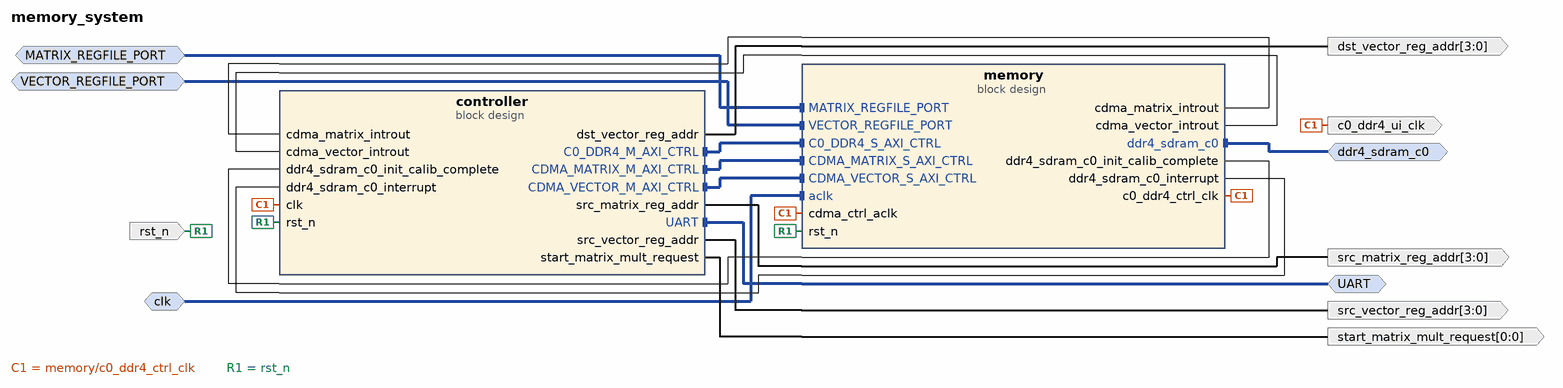
[diagram p0: block diagram of the top level]
# Vivado block design memory_system, xcu250-figd2104-2L-e, Vivado 2024.1
create_bd_design memory_system

create_bd_intf_port -mode Slave -vlnv xilinx.com:interface:diff_clock_rtl:1.0 clk
set_property -dict {CONFIG.FREQ_HZ 300000000} [get_bd_intf_ports clk]
create_bd_intf_port -mode Master -vlnv xilinx.com:interface:ddr4_rtl:1.0 ddr4_sdram_c0
create_bd_intf_port -mode Slave -vlnv xilinx.com:interface:bram_rtl:1.0 MATRIX_REGFILE_PORT
set_property -dict {CONFIG.READ_WRITE_MODE READ_WRITE} [get_bd_intf_ports MATRIX_REGFILE_PORT]
create_bd_intf_port -mode Slave -vlnv xilinx.com:interface:bram_rtl:1.0 VECTOR_REGFILE_PORT
set_property -dict {CONFIG.READ_WRITE_MODE READ_WRITE} [get_bd_intf_ports VECTOR_REGFILE_PORT]
create_bd_intf_port -mode Master -vlnv xilinx.com:interface:uart_rtl:1.0 UART
create_bd_port -dir I -type rst rst_n
set_property -dict {CONFIG.POLARITY ACTIVE_LOW} [get_bd_ports rst_n]
create_bd_port -dir O -from 0 -to 0 start_matrix_mult_request
create_bd_port -dir O -from 3 -to 0 src_matrix_reg_addr
create_bd_port -dir O -from 3 -to 0 src_vector_reg_addr
create_bd_port -dir O -from 3 -to 0 dst_vector_reg_addr
create_bd_port -dir O -type clk c0_ddr4_ui_clk

create_bd_cell -type container -reference controller controller
set_property -dict [list \
  CONFIG.ACTIVE_SIM_BD controller.bd \
  CONFIG.ACTIVE_SYNTH_BD controller.bd \
  CONFIG.ENABLE_DFX 0 \
  CONFIG.LIST_SIM_BD controller.bd \
  CONFIG.LIST_SYNTH_BD controller.bd \
  CONFIG.LOCK_PROPAGATE 0 \
] [get_bd_cells controller]
create_bd_cell -type container -reference memory memory
set_property -dict [list \
  CONFIG.ACTIVE_SIM_BD memory.bd \
  CONFIG.ACTIVE_SYNTH_BD memory.bd \
  CONFIG.ENABLE_DFX 0 \
  CONFIG.LIST_SIM_BD memory.bd \
  CONFIG.LIST_SYNTH_BD memory.bd \
  CONFIG.LOCK_PROPAGATE 0 \
] [get_bd_cells memory]

# ---- connections ----

connect_bd_intf_net -intf_net MATRIX_REGFILE_PORT_0_1 [get_bd_intf_ports MATRIX_REGFILE_PORT] [get_bd_intf_pins memory/MATRIX_REGFILE_PORT]
connect_bd_intf_net -intf_net VECTOR_REGFILE_PORT_0_1 [get_bd_intf_ports VECTOR_REGFILE_PORT] [get_bd_intf_pins memory/VECTOR_REGFILE_PORT]
connect_bd_intf_net -intf_net controller_C0_DDR4_S_AXI_CTRL [get_bd_intf_pins controller/C0_DDR4_M_AXI_CTRL] [get_bd_intf_pins memory/C0_DDR4_S_AXI_CTRL]
connect_bd_intf_net -intf_net controller_CDMA_MATRIX_S_AXI_CTRL [get_bd_intf_pins controller/CDMA_MATRIX_M_AXI_CTRL] [get_bd_intf_pins memory/CDMA_MATRIX_S_AXI_CTRL]
connect_bd_intf_net -intf_net controller_CDMA_VECTOR_S_AXI_CTRL [get_bd_intf_pins controller/CDMA_VECTOR_M_AXI_CTRL] [get_bd_intf_pins memory/CDMA_VECTOR_S_AXI_CTRL]
connect_bd_intf_net [get_bd_intf_ports UART] [get_bd_intf_pins controller/UART]
connect_bd_intf_net -intf_net default_300mhz_clk0_1 [get_bd_intf_ports clk] [get_bd_intf_pins memory/aclk]
connect_bd_intf_net -intf_net memory_0_ddr4_sdram_c0 [get_bd_intf_ports ddr4_sdram_c0] [get_bd_intf_pins memory/ddr4_sdram_c0]
connect_bd_net [get_bd_pins controller/dst_vector_reg_addr] [get_bd_ports dst_vector_reg_addr]
connect_bd_net [get_bd_pins controller/src_matrix_reg_addr] [get_bd_ports src_matrix_reg_addr]
connect_bd_net [get_bd_pins controller/src_vector_reg_addr] [get_bd_ports src_vector_reg_addr]
connect_bd_net [get_bd_pins controller/start_matrix_mult_request] [get_bd_ports start_matrix_mult_request]
connect_bd_net [get_bd_pins memory/c0_ddr4_ctrl_clk] [get_bd_ports c0_ddr4_ui_clk] [get_bd_pins controller/clk] [get_bd_pins memory/cdma_ctrl_aclk]
connect_bd_net [get_bd_pins memory/cdma_matrix_introut] [get_bd_pins controller/cdma_matrix_introut]
connect_bd_net [get_bd_pins memory/cdma_vector_introut] [get_bd_pins controller/cdma_vector_introut]
connect_bd_net [get_bd_pins memory/ddr4_sdram_c0_init_calib_complete] [get_bd_pins controller/ddr4_sdram_c0_init_calib_complete]
connect_bd_net [get_bd_pins memory/ddr4_sdram_c0_interrupt] [get_bd_pins controller/ddr4_sdram_c0_interrupt]
connect_bd_net -net resetn_1 [get_bd_ports rst_n] [get_bd_pins controller/rst_n] [get_bd_pins memory/rst_n]

# ---- address map ----
assign_bd_address -offset 0x00000000 -range 128K -target_address_space [get_bd_addr_spaces controller/microblaze_riscv/Data] [get_bd_addr_segs controller/microblaze_riscv_local_memory/dlmb_bram_if_cntlr/SLMB/Mem]
assign_bd_address -offset 0x40000000 -range 64K -target_address_space [get_bd_addr_spaces controller/microblaze_riscv/Data] [get_bd_addr_segs controller/axi_gpio/S_AXI/Reg]
assign_bd_address -offset 0x40600000 -range 64K -target_address_space [get_bd_addr_spaces controller/microblaze_riscv/Data] [get_bd_addr_segs controller/axi_uartlite/S_AXI/Reg]
assign_bd_address -offset 0x44A00000 -range 64K -target_address_space [get_bd_addr_spaces controller/microblaze_riscv/Data] [get_bd_addr_segs memory/axi_cdma_matrix/S_AXI_LITE/Reg]
assign_bd_address -offset 0x44A10000 -range 64K -target_address_space [get_bd_addr_spaces controller/microblaze_riscv/Data] [get_bd_addr_segs memory/axi_cdma_vector/S_AXI_LITE/Reg]
assign_bd_address -offset 0x80000000 -range 1M -target_address_space [get_bd_addr_spaces controller/microblaze_riscv/Data] [get_bd_addr_segs memory/ddr4_ctrl_c0/C0_DDR4_MEMORY_MAP_CTRL/C0_REG]
assign_bd_address -offset 0x00000000 -range 128K -target_address_space [get_bd_addr_spaces controller/microblaze_riscv/Instruction] [get_bd_addr_segs controller/microblaze_riscv_local_memory/ilmb_bram_if_cntlr/SLMB/Mem]
assign_bd_address -offset 0x0C0000000 -range 32K -target_address_space [get_bd_addr_spaces memory/axi_cdma_matrix/Data] [get_bd_addr_segs memory/axi_bram_ctrl_matrix/S_AXI/Mem0]
assign_bd_address -offset 0x200000000 -range 8G -target_address_space [get_bd_addr_spaces memory/axi_cdma_matrix/Data] [get_bd_addr_segs memory/ddr4_ctrl_c0/C0_DDR4_MEMORY_MAP/C0_DDR4_ADDRESS_BLOCK]
assign_bd_address -offset 0x0C0000000 -range 4K -target_address_space [get_bd_addr_spaces memory/axi_cdma_vector/Data] [get_bd_addr_segs memory/axi_bram_ctrl_vector/S_AXI/Mem0]
assign_bd_address -offset 0x200000000 -range 8G -target_address_space [get_bd_addr_spaces memory/axi_cdma_vector/Data] [get_bd_addr_segs memory/ddr4_ctrl_c0/C0_DDR4_MEMORY_MAP/C0_DDR4_ADDRESS_BLOCK]

validate_bd_design
save_bd_design
